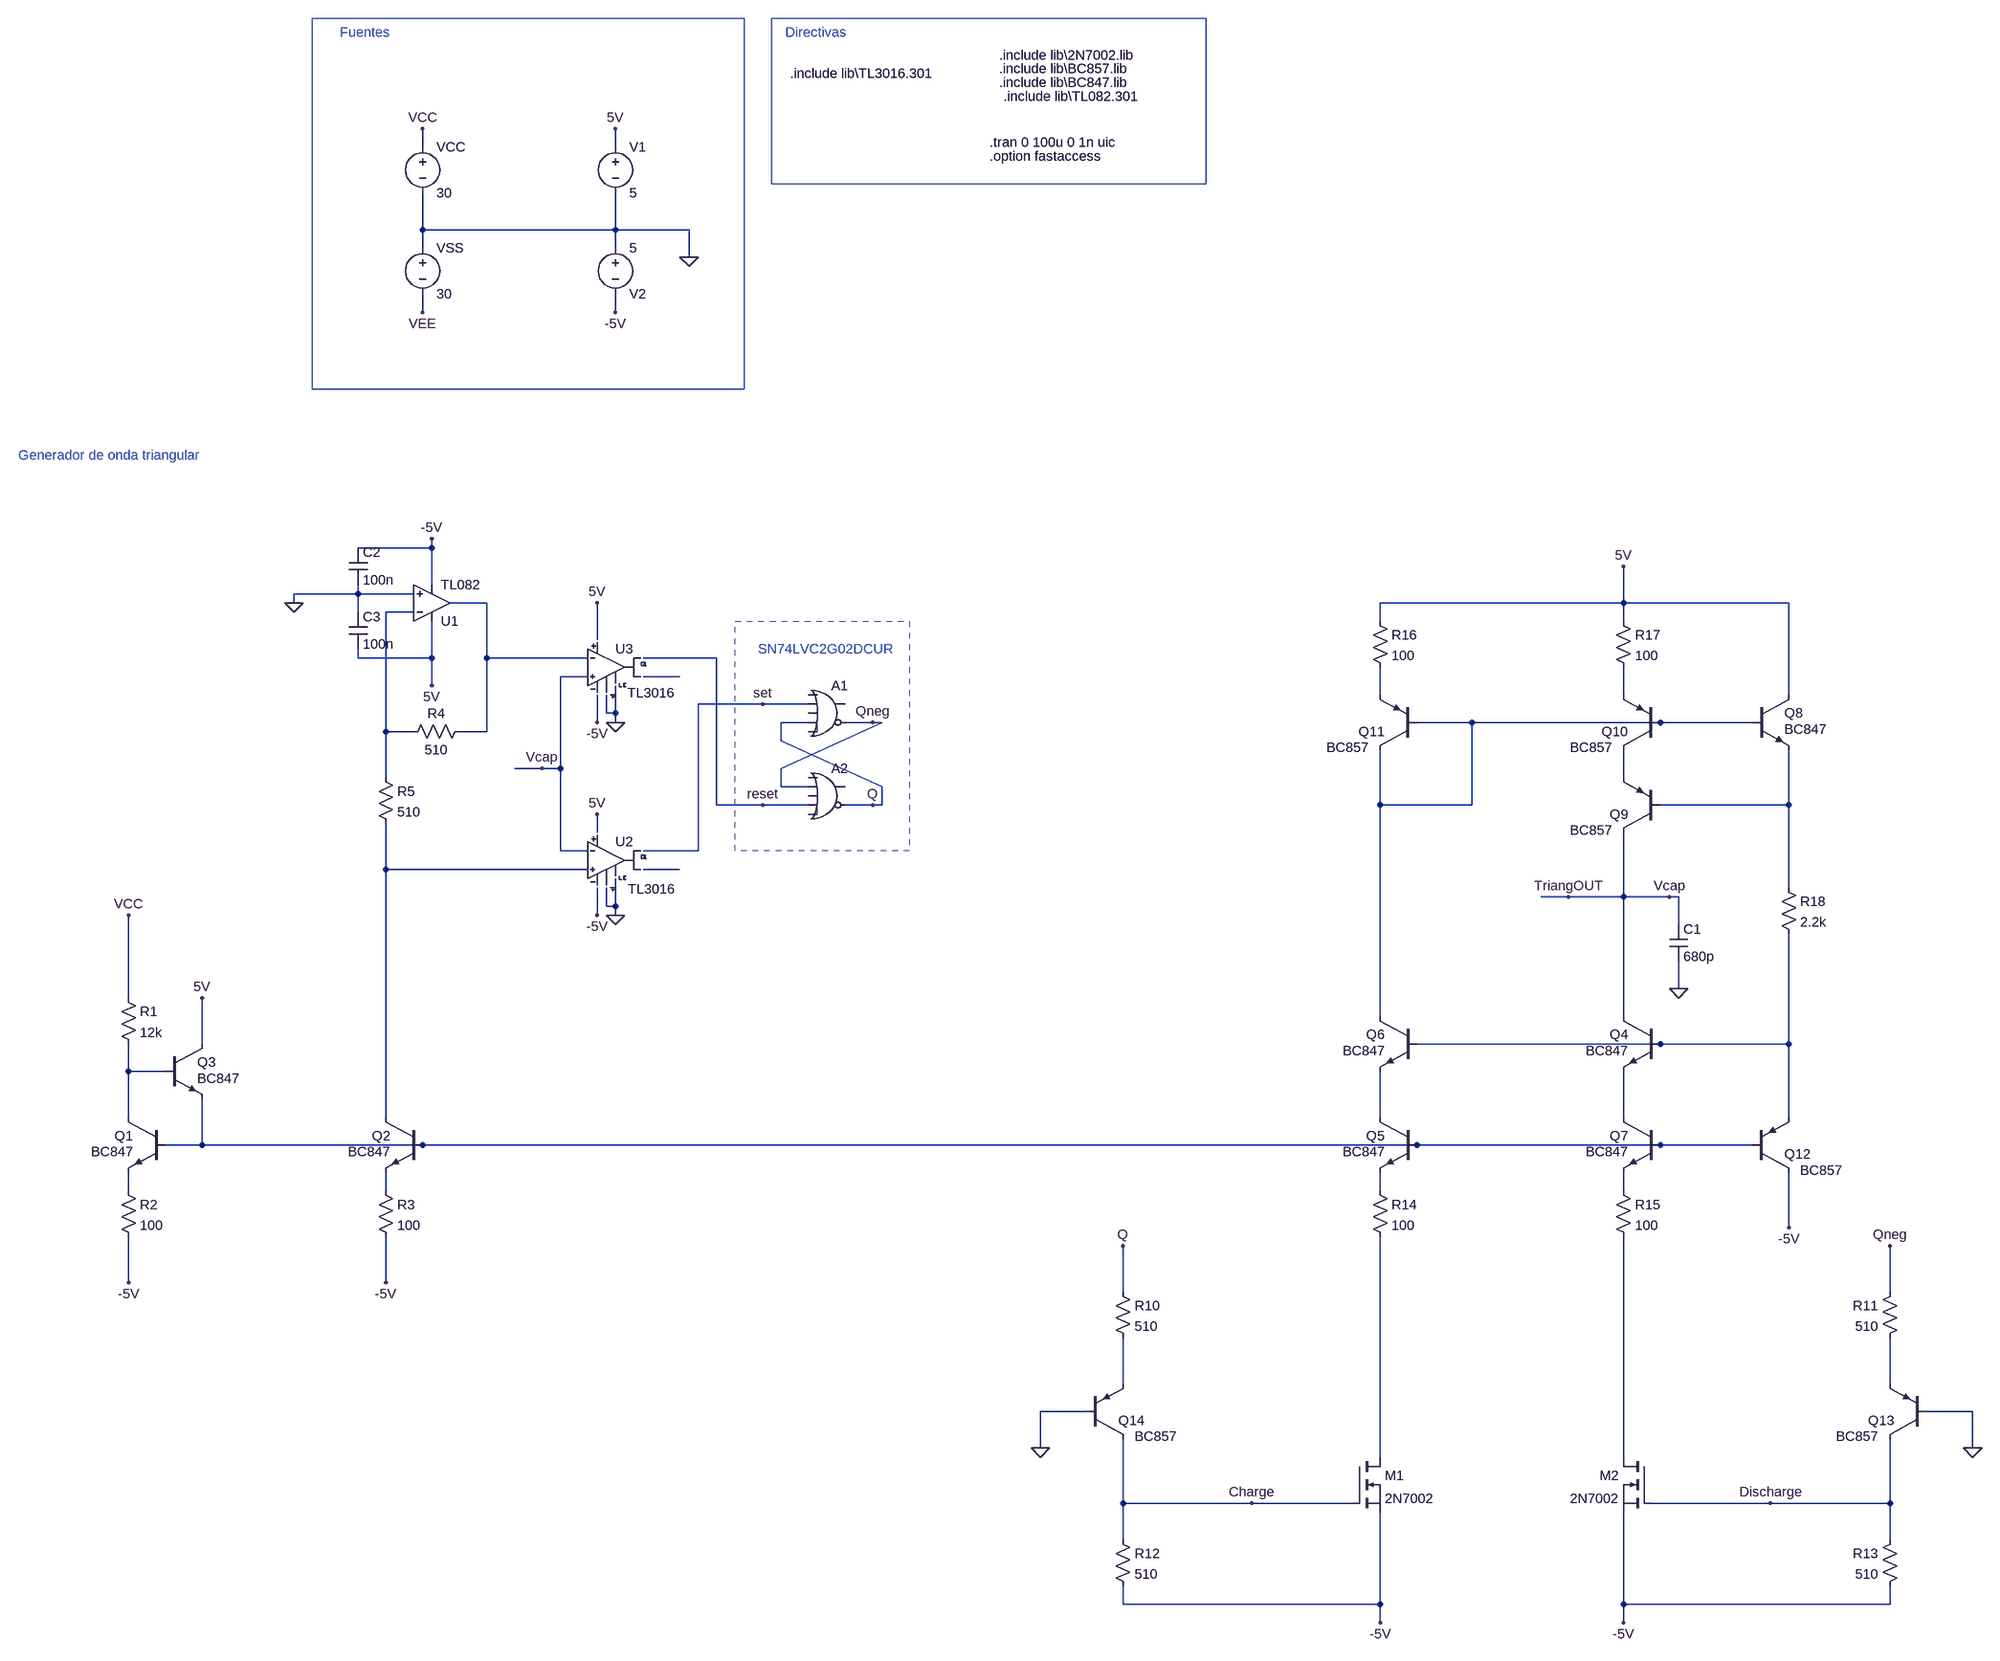
[diagram p0: schematic TRIANGULAR.asc]
TRIANGULAR.asc, the LTspice schematic file:
Version 4
SHEET 1 7252 3776
WIRE -1360 -640 -1360 -672
WIRE -1024 -640 -1024 -672
WIRE -1360 -496 -1360 -560
WIRE -1024 -496 -1024 -560
WIRE -1024 -496 -1360 -496
WIRE -896 -496 -1024 -496
WIRE -1360 -464 -1360 -496
WIRE -1024 -464 -1024 -496
WIRE -896 -448 -896 -496
WIRE -1360 -352 -1360 -384
WIRE -1024 -352 -1024 -384
WIRE -1344 240 -1344 224
WIRE -1344 240 -1472 240
WIRE -1344 304 -1344 240
WIRE -1472 320 -1472 304
WIRE -1472 320 -1584 320
WIRE -1376 320 -1472 320
WIRE -1584 336 -1584 320
WIRE -1248 336 -1312 336
WIRE 800 336 800 272
WIRE 800 336 368 336
WIRE 1088 336 800 336
WIRE -1472 352 -1472 320
WIRE -1376 352 -1424 352
WIRE 368 368 368 336
WIRE 800 368 800 336
WIRE -1056 400 -1056 336
WIRE -1472 432 -1472 416
WIRE -1344 432 -1344 368
WIRE -1344 432 -1472 432
WIRE -1248 432 -1248 336
WIRE -1072 432 -1248 432
WIRE -848 432 -976 432
WIRE -1072 464 -1120 464
WIRE -912 464 -976 464
WIRE -1344 480 -1344 432
WIRE 368 496 368 448
WIRE 800 496 800 448
WIRE 1088 496 1088 336
WIRE -768 512 -880 512
WIRE -688 512 -768 512
WIRE -1040 528 -1040 496
WIRE -1024 528 -1024 480
WIRE -1024 528 -1040 528
WIRE -1056 544 -1056 496
WIRE -1024 544 -1024 528
WIRE -688 544 -736 544
WIRE -576 544 -624 544
WIRE -560 544 -576 544
WIRE 528 544 432 544
WIRE 864 544 528 544
WIRE 1024 544 864 544
WIRE -1424 560 -1424 352
WIRE -1376 560 -1424 560
WIRE -1248 560 -1248 432
WIRE -1248 560 -1296 560
WIRE -736 576 -736 544
WIRE -1152 624 -1200 624
WIRE -1120 624 -1120 464
WIRE -1120 624 -1152 624
WIRE -736 624 -560 544
WIRE -1424 640 -1424 560
WIRE 800 640 800 592
WIRE -736 656 -736 624
WIRE -688 656 -736 656
WIRE -560 656 -736 576
WIRE -848 688 -848 432
WIRE -768 688 -848 688
WIRE -688 688 -768 688
WIRE -576 688 -624 688
WIRE -560 688 -560 656
WIRE -560 688 -576 688
WIRE 368 688 368 592
WIRE 528 688 528 544
WIRE 528 688 368 688
WIRE 1088 688 1088 592
WIRE 1088 688 864 688
WIRE -1056 736 -1056 704
WIRE -1120 768 -1120 624
WIRE -1072 768 -1120 768
WIRE -880 768 -880 512
WIRE -880 768 -976 768
WIRE -1424 800 -1424 720
WIRE -1072 800 -1424 800
WIRE -912 800 -976 800
WIRE 1088 832 1088 688
WIRE 704 848 656 848
WIRE 800 848 800 736
WIRE 800 848 704 848
WIRE 880 848 800 848
WIRE 896 848 880 848
WIRE -1040 864 -1040 832
WIRE -1024 864 -1024 816
WIRE -1024 864 -1040 864
WIRE -1056 880 -1056 832
WIRE -1024 880 -1024 864
WIRE 896 896 896 848
WIRE 896 1008 896 960
WIRE -1872 1024 -1872 880
WIRE 368 1056 368 688
WIRE 800 1056 800 848
WIRE -1744 1104 -1744 1024
WIRE 864 1104 432 1104
WIRE 1088 1104 1088 912
WIRE 1088 1104 864 1104
WIRE -1872 1152 -1872 1104
WIRE -1808 1152 -1872 1152
WIRE -1872 1232 -1872 1152
WIRE -1424 1232 -1424 800
WIRE 368 1232 368 1152
WIRE 800 1232 800 1152
WIRE 1088 1232 1088 1104
WIRE -1744 1280 -1744 1200
WIRE -1744 1280 -1808 1280
WIRE -1360 1280 -1744 1280
WIRE 432 1280 -1360 1280
WIRE 864 1280 432 1280
WIRE 1024 1280 864 1280
WIRE -1872 1360 -1872 1328
WIRE -1424 1360 -1424 1328
WIRE 368 1360 368 1328
WIRE 800 1360 800 1328
WIRE 1088 1424 1088 1328
WIRE -1872 1520 -1872 1440
WIRE -1424 1520 -1424 1440
WIRE -80 1536 -80 1456
WIRE 1264 1536 1264 1456
WIRE -80 1696 -80 1616
WIRE 1264 1696 1264 1616
WIRE -144 1744 -224 1744
WIRE 1408 1744 1328 1744
WIRE -224 1808 -224 1744
WIRE 1408 1808 1408 1744
WIRE 368 1824 368 1440
WIRE 800 1824 800 1440
WIRE -80 1904 -80 1792
WIRE 144 1904 -80 1904
WIRE 320 1904 144 1904
WIRE 1056 1904 848 1904
WIRE 1264 1904 1264 1792
WIRE 1264 1904 1056 1904
WIRE -80 1968 -80 1904
WIRE 1264 1968 1264 1904
WIRE -80 2080 -80 2048
WIRE 368 2080 368 1920
WIRE 368 2080 -80 2080
WIRE 800 2080 800 1920
WIRE 1264 2080 1264 2048
WIRE 1264 2080 800 2080
WIRE 368 2112 368 2080
WIRE 800 2112 800 2080
FLAG -1360 -672 VCC
FLAG -1360 -352 VEE
FLAG -1024 -672 5V
FLAG -1024 -352 -5V
FLAG -896 -448 0
FLAG -768 512 set
FLAG -768 688 reset
FLAG 880 848 Vcap
FLAG 704 848 TriangOUT
FLAG 896 1008 0
FLAG -1024 544 0
FLAG -1024 880 0
FLAG -1584 336 0
FLAG -1056 336 5V
FLAG -1056 704 5V
FLAG 800 272 5V
FLAG -1744 1024 5V
FLAG -1872 880 VCC
FLAG -1872 1520 -5V
FLAG -1424 1520 -5V
FLAG -1056 880 -5V
FLAG -1056 544 -5V
FLAG 1088 1424 -5V
FLAG -1344 480 5V
FLAG -1344 224 -5V
FLAG -576 544 Qneg
FLAG -576 688 Q
FLAG 368 2112 -5V
FLAG 800 2112 -5V
FLAG -224 1808 0
FLAG -80 1456 Q
FLAG 1264 1456 Qneg
FLAG 1408 1808 0
FLAG 1056 1904 Discharge
FLAG 144 1904 Charge
FLAG -1152 624 Vcap
SYMBOL voltage -1360 -656 R0
WINDOW 123 0 0 Left 2
WINDOW 39 0 0 Left 2
SYMATTR InstName VCC
SYMATTR Value 30
SYMBOL voltage -1360 -480 R0
WINDOW 123 0 0 Left 2
WINDOW 39 0 0 Left 2
SYMATTR InstName VSS
SYMATTR Value 30
SYMBOL voltage -1024 -656 R0
SYMATTR InstName V1
SYMATTR Value 5
SYMBOL voltage -1024 -480 R0
WINDOW 0 24 96 Left 2
WINDOW 3 24 16 Left 2
WINDOW 123 0 0 Left 0
WINDOW 39 0 0 Left 0
SYMATTR InstName V2
SYMATTR Value 5
SYMBOL TL3016 -1040 448 R0
WINDOW 38 37 45 Left 2
SYMATTR InstName U3
SYMBOL TL3016 -1040 784 R0
WINDOW 38 38 50 Left 2
SYMATTR InstName U2
SYMBOL Digital\\or -656 464 R0
SYMATTR InstName A1
SYMATTR Value2 Vhigh=5 Vlow=0 td=5ns
SYMBOL Digital\\or -656 608 R0
SYMATTR InstName A2
SYMATTR Value2 Vhigh=5 Vlow=0 td=5ns
SYMBOL res -1280 544 R90
WINDOW 0 0 56 VBottom 2
WINDOW 3 32 56 VTop 2
SYMATTR InstName R4
SYMATTR Value 510
SYMBOL res -1440 624 R0
SYMATTR InstName R5
SYMATTR Value 510
SYMBOL res -1888 1344 R0
SYMATTR InstName R2
SYMATTR Value 100
SYMBOL res -1440 1344 R0
SYMATTR InstName R3
SYMATTR Value 100
SYMBOL res -1888 1008 R0
SYMATTR InstName R1
SYMATTR Value 12k
SYMBOL npn 432 1056 M0
WINDOW 3 56 68 Invisible 2
WINDOW 38 56 60 Left 2
SYMATTR Value ""
SYMATTR SpiceModel BC847
SYMATTR InstName Q6
SYMATTR Prefix X
SYMBOL res 352 1344 R0
SYMATTR InstName R14
SYMATTR Value 100
SYMBOL res 784 1344 R0
SYMATTR InstName R15
SYMATTR Value 100
SYMBOL res 352 352 R0
SYMATTR InstName R16
SYMATTR Value 100
SYMBOL res 784 352 R0
SYMATTR InstName R17
SYMATTR Value 100
SYMBOL res 1072 816 R0
SYMATTR InstName R18
SYMATTR Value 2.2k
SYMBOL cap 880 896 R0
SYMATTR InstName C1
SYMATTR Value 680p
SYMBOL nmos 320 1824 R0
SYMATTR InstName M1
SYMATTR Value 2N7002
SYMATTR Prefix X
SYMBOL nmos 848 1824 M0
SYMATTR InstName M2
SYMATTR Value 2N7002
SYMATTR Prefix X
SYMBOL res -96 1520 R0
SYMATTR InstName R10
SYMATTR Value 510
SYMBOL res 1280 1520 M0
SYMATTR InstName R11
SYMATTR Value 510
SYMBOL res -96 1952 R0
SYMATTR InstName R12
SYMATTR Value 510
SYMBOL res 1280 1952 M0
SYMATTR InstName R13
SYMATTR Value 510
SYMBOL npn 864 1056 M0
WINDOW 3 56 68 Invisible 2
WINDOW 38 56 60 Left 2
SYMATTR Value ""
SYMATTR SpiceModel BC847
SYMATTR InstName Q4
SYMATTR Prefix X
SYMBOL npn 432 1232 M0
WINDOW 3 56 68 Invisible 2
WINDOW 38 56 60 Left 2
SYMATTR Value ""
SYMATTR SpiceModel BC847
SYMATTR InstName Q5
SYMATTR Prefix X
SYMBOL npn 864 1232 M0
WINDOW 3 56 68 Invisible 2
WINDOW 38 56 60 Left 2
SYMATTR Value ""
SYMATTR SpiceModel BC847
SYMATTR InstName Q7
SYMATTR Prefix X
SYMBOL npn -1808 1232 M0
WINDOW 3 56 68 Invisible 2
WINDOW 38 56 60 Left 2
SYMATTR Value ""
SYMATTR SpiceModel BC847
SYMATTR InstName Q1
SYMATTR Prefix X
SYMBOL npn -1360 1232 M0
WINDOW 3 56 68 Invisible 2
WINDOW 38 56 60 Left 2
SYMATTR Value ""
SYMATTR SpiceModel BC847
SYMATTR InstName Q2
SYMATTR Prefix X
SYMBOL pnp 864 736 R180
WINDOW 3 84 68 Invisible 2
WINDOW 38 84 4 Left 2
SYMATTR Value ""
SYMATTR SpiceModel BC857
SYMATTR InstName Q9
SYMATTR Prefix X
SYMBOL npn -1808 1104 R0
WINDOW 3 56 68 Invisible 2
WINDOW 38 56 60 Left 2
SYMATTR Value ""
SYMATTR SpiceModel BC847
SYMATTR InstName Q3
SYMATTR Prefix X
SYMBOL npn 1024 496 R0
WINDOW 3 56 68 Invisible 2
WINDOW 38 56 60 Left 2
SYMATTR Value ""
SYMATTR SpiceModel BC847
SYMATTR InstName Q8
SYMATTR Prefix X
SYMBOL pnp 864 592 R180
WINDOW 3 84 68 Invisible 2
WINDOW 38 84 4 Left 2
SYMATTR Value ""
SYMATTR SpiceModel BC857
SYMATTR InstName Q10
SYMATTR Prefix X
SYMBOL pnp 432 592 R180
WINDOW 3 84 68 Invisible 2
WINDOW 38 84 4 Left 2
SYMATTR Value ""
SYMATTR SpiceModel BC857
SYMATTR InstName Q11
SYMATTR Prefix X
SYMBOL pnp 1024 1328 M180
WINDOW 3 84 68 Invisible 2
WINDOW 38 84 4 Left 2
SYMATTR Value ""
SYMATTR SpiceModel BC857
SYMATTR InstName Q12
SYMATTR Prefix X
SYMBOL pnp 1328 1792 R180
WINDOW 3 84 68 Invisible 2
WINDOW 38 84 4 Left 2
SYMATTR Value ""
SYMATTR SpiceModel BC857
SYMATTR InstName Q13
SYMATTR Prefix X
SYMBOL pnp -144 1792 M180
WINDOW 3 84 68 Invisible 2
WINDOW 38 84 4 Left 2
SYMATTR Value ""
SYMATTR SpiceModel BC857
SYMATTR InstName Q14
SYMATTR Prefix X
SYMBOL Opamps\\opamp2 -1344 400 M180
SYMATTR InstName U1
SYMATTR Value TL082
SYMBOL cap -1488 240 R0
SYMATTR InstName C2
SYMATTR Value 100n
SYMBOL cap -1488 352 R0
SYMATTR InstName C3
SYMATTR Value 100n
TEXT -312 -648 Left 2 !.tran 0 100u 0 1n uic
TEXT -1504 -840 Left 2 ;Fuentes
TEXT -728 -840 Left 2 ;Directivas
TEXT -720 -768 Left 2 !.include lib\\TL3016.301
TEXT -312 -624 Left 2 !.option fastaccess
TEXT -2064 32 Left 2 ;Generador de onda triangular
TEXT -776 416 Left 2 ;SN74LVC2G02DCUR
TEXT -296 -800 Left 2 !.include lib\\2N7002.lib
TEXT -296 -776 Left 2 !.include lib\\BC857.lib
TEXT -296 -752 Left 2 !.include lib\\BC847.lib
TEXT -288 -728 Left 2 !.include lib\\TL082.301
RECTANGLE Normal -1552 -864 -800 -208
RECTANGLE Normal 64 -864 -752 -576
RECTANGLE Normal -512 768 -816 368 2

The netlist it stands for:
* TRIANGULAR.asc
VCC VCC 0 30
VSS 0 VEE 30
V1 5V 0 5
V2 0 -5V 5
XU3 TriangOUT N001 5V -5V reset N003 0 0 TL3016  ; pins In+ In- V+ V- Q Qneg LE GND
XU2 N009 TriangOUT 5V -5V set N010 0 0 TL3016  ; pins In+ In- V+ V- Q Qneg LE GND
A1 0 set 0 Q 0 Qneg 0 0 OR Vhigh=5 Vlow=0 td=5ns
A2 0 Qneg 0 reset 0 Q 0 0 OR Vhigh=5 Vlow=0 td=5ns
R4 N001 N002 510
R5 N002 N009 510
R2 N016 -5V 100
R3 N017 -5V 100
R1 VCC N012 12k
XQ6 N006 N011 N013 BC847  ; pins C B E
R14 N018 N022 100
R15 N019 N023 100
R16 5V N004 100
R17 5V N005 100
R18 N008 N011 2.2k
C1 TriangOUT 0 680p
XM1 N022 Charge -5V 2N7002  ; pins D G S
XM2 N023 Discharge -5V 2N7002  ; pins D G S
R10 Q N020 510
R11 Qneg N021 510
R12 Charge -5V 510
R13 Discharge -5V 510
XQ4 TriangOUT N011 N014 BC847  ; pins C B E
XQ5 N013 N015 N018 BC847  ; pins C B E
XQ7 N014 N015 N019 BC847  ; pins C B E
XQ1 N012 N015 N016 BC847  ; pins C B E
XQ2 N009 N015 N017 BC847  ; pins C B E
XQ9 TriangOUT N008 N007 BC857  ; pins C B E
XQ3 5V N012 N015 BC847  ; pins C B E
XQ8 5V N006 N008 BC847  ; pins C B E
XQ10 N007 N006 N005 BC857  ; pins C B E
XQ11 N006 N006 N004 BC857  ; pins C B E
XQ12 -5V N015 N011 BC857  ; pins C B E
XQ13 Discharge 0 N021 BC857  ; pins C B E
XQ14 Charge 0 N020 BC857  ; pins C B E
XU1 0 N002 5V -5V N001 TL082  ; pins In+ In- V+ V- OUT
C2 -5V 0 100n
C3 0 5V 100n
.tran 0 100u 0 1n uic
* Fuentes
* Directivas
.include lib\TL3016.301
.option fastaccess
* Generador de onda triangular
* SN74LVC2G02DCUR
.include lib\2N7002.lib
.include lib\BC857.lib
.include lib\BC847.lib
.include lib\TL082.301
.backanno
.end